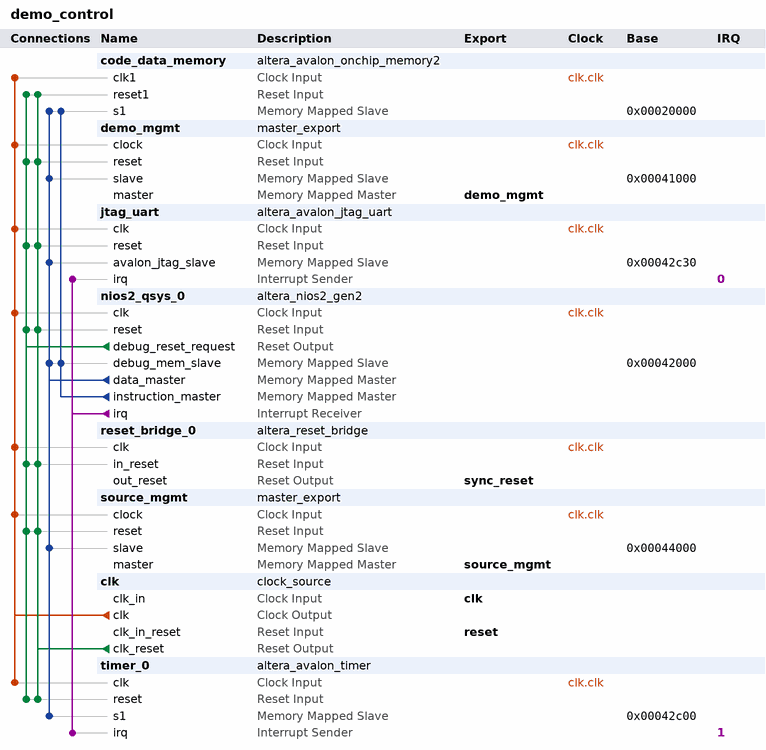
[diagram p0: system contents]
# Platform Designer (Qsys) system demo_control, Stratix 10 1SG280LN3F43E1VG
# Parameters at their usual value, and those the tool derives, are not listed.
package require -exact qsys 1.0
create_system demo_control
set_project_property DEVICE_FAMILY {Stratix 10}
set_project_property DEVICE 1SG280LN3F43E1VG

add_component code_data_memory ip/demo_control/demo_control_code_data_memory.ip altera_avalon_onchip_memory2 code_data_memory 16.1

add_component demo_mgmt ip/demo_control/demo_control_demo_mgmt.ip master_export demo_mgmt 1.0

add_component jtag_uart ip/demo_control/demo_control_jtag_uart.ip altera_avalon_jtag_uart jtag_uart 16.1

add_component nios2_qsys_0 ip/demo_control/demo_control_nios2_qsys_0.ip altera_nios2_gen2 nios2_qsys_0 16.1

add_component reset_bridge_0 ip/demo_control/demo_control_reset_bridge_0.ip altera_reset_bridge reset_bridge_0 16.1

add_component source_mgmt ip/demo_control/demo_control_source_mgmt.ip master_export source_mgmt 1.0

add_component clk ip/demo_control/demo_control_clk.ip clock_source clk 

add_component timer_0 ip/demo_control/demo_control_timer_0.ip altera_avalon_timer timer_0 16.1

# connections
add_connection clk.clk code_data_memory.clk1 clock
add_connection clk.clk demo_mgmt.clock clock
add_connection clk.clk jtag_uart.clk clock
add_connection clk.clk nios2_qsys_0.clk clock
add_connection clk.clk reset_bridge_0.clk clock
add_connection clk.clk source_mgmt.clock clock
add_connection clk.clk timer_0.clk clock
add_connection clk.clk_reset code_data_memory.reset1 reset
add_connection clk.clk_reset demo_mgmt.reset reset
add_connection clk.clk_reset jtag_uart.reset reset
add_connection clk.clk_reset nios2_qsys_0.reset reset
add_connection clk.clk_reset reset_bridge_0.in_reset reset
add_connection clk.clk_reset source_mgmt.reset reset
add_connection clk.clk_reset timer_0.reset reset
add_connection nios2_qsys_0.debug_reset_request code_data_memory.reset1 reset
add_connection nios2_qsys_0.debug_reset_request demo_mgmt.reset reset
add_connection nios2_qsys_0.debug_reset_request jtag_uart.reset reset
add_connection nios2_qsys_0.debug_reset_request nios2_qsys_0.reset reset
add_connection nios2_qsys_0.debug_reset_request reset_bridge_0.in_reset reset
add_connection nios2_qsys_0.debug_reset_request source_mgmt.reset reset
add_connection nios2_qsys_0.debug_reset_request timer_0.reset reset
add_connection nios2_qsys_0.data_master code_data_memory.s1 avalon
set_connection_parameter_value nios2_qsys_0.data_master/code_data_memory.s1 baseAddress 0x00020000
add_connection nios2_qsys_0.data_master demo_mgmt.slave avalon
set_connection_parameter_value nios2_qsys_0.data_master/demo_mgmt.slave baseAddress 0x00041000
add_connection nios2_qsys_0.data_master jtag_uart.avalon_jtag_slave avalon
set_connection_parameter_value nios2_qsys_0.data_master/jtag_uart.avalon_jtag_slave baseAddress 0x00042c30
add_connection nios2_qsys_0.data_master nios2_qsys_0.debug_mem_slave avalon
set_connection_parameter_value nios2_qsys_0.data_master/nios2_qsys_0.debug_mem_slave baseAddress 0x00042000
add_connection nios2_qsys_0.data_master source_mgmt.slave avalon
set_connection_parameter_value nios2_qsys_0.data_master/source_mgmt.slave baseAddress 0x00044000
add_connection nios2_qsys_0.data_master timer_0.s1 avalon
set_connection_parameter_value nios2_qsys_0.data_master/timer_0.s1 baseAddress 0x00042c00
add_connection nios2_qsys_0.instruction_master code_data_memory.s1 avalon
set_connection_parameter_value nios2_qsys_0.instruction_master/code_data_memory.s1 baseAddress 0x00020000
add_connection nios2_qsys_0.instruction_master nios2_qsys_0.debug_mem_slave avalon
set_connection_parameter_value nios2_qsys_0.instruction_master/nios2_qsys_0.debug_mem_slave baseAddress 0x00042000
add_connection nios2_qsys_0.irq jtag_uart.irq interrupt
set_connection_parameter_value nios2_qsys_0.irq/jtag_uart.irq irqNumber 0
add_connection nios2_qsys_0.irq timer_0.irq interrupt
set_connection_parameter_value nios2_qsys_0.irq/timer_0.irq irqNumber 1

# exported interfaces
add_interface clk clock sink
set_interface_property clk EXPORT_OF clk.clk_in
add_interface demo_mgmt avalon master
set_interface_property demo_mgmt EXPORT_OF demo_mgmt.master
add_interface reset reset sink
set_interface_property reset EXPORT_OF clk.clk_in_reset
add_interface source_mgmt avalon master
set_interface_property source_mgmt EXPORT_OF source_mgmt.master
add_interface sync_reset reset source
set_interface_property sync_reset EXPORT_OF reset_bridge_0.out_reset

set_interconnect_requirement {$system} qsys_mm.clockCrossingAdapter HANDSHAKE
set_interconnect_requirement {$system} qsys_mm.maxAdditionalLatency 1

save_system demo_control.qsys
